# Altium schematic sheet Плата печатная.SchDoc
size 420 x 297 mm; Децимальный номер: СФ МЭИ КР ПЭ2-18 11.03.04 03; Наименование. Строка 2: плата; Наименование. Строка 1: Печатная; Разработал: Гончаренко В.Ю.; Проверил: Смолин В.А.; Утвердил: Рассказа Д,С.; Литера: У; Масштаб: 2:1; Лист. Номер: 1; Лист. Всего: 4; Организация: НИУ СФ МЭИ
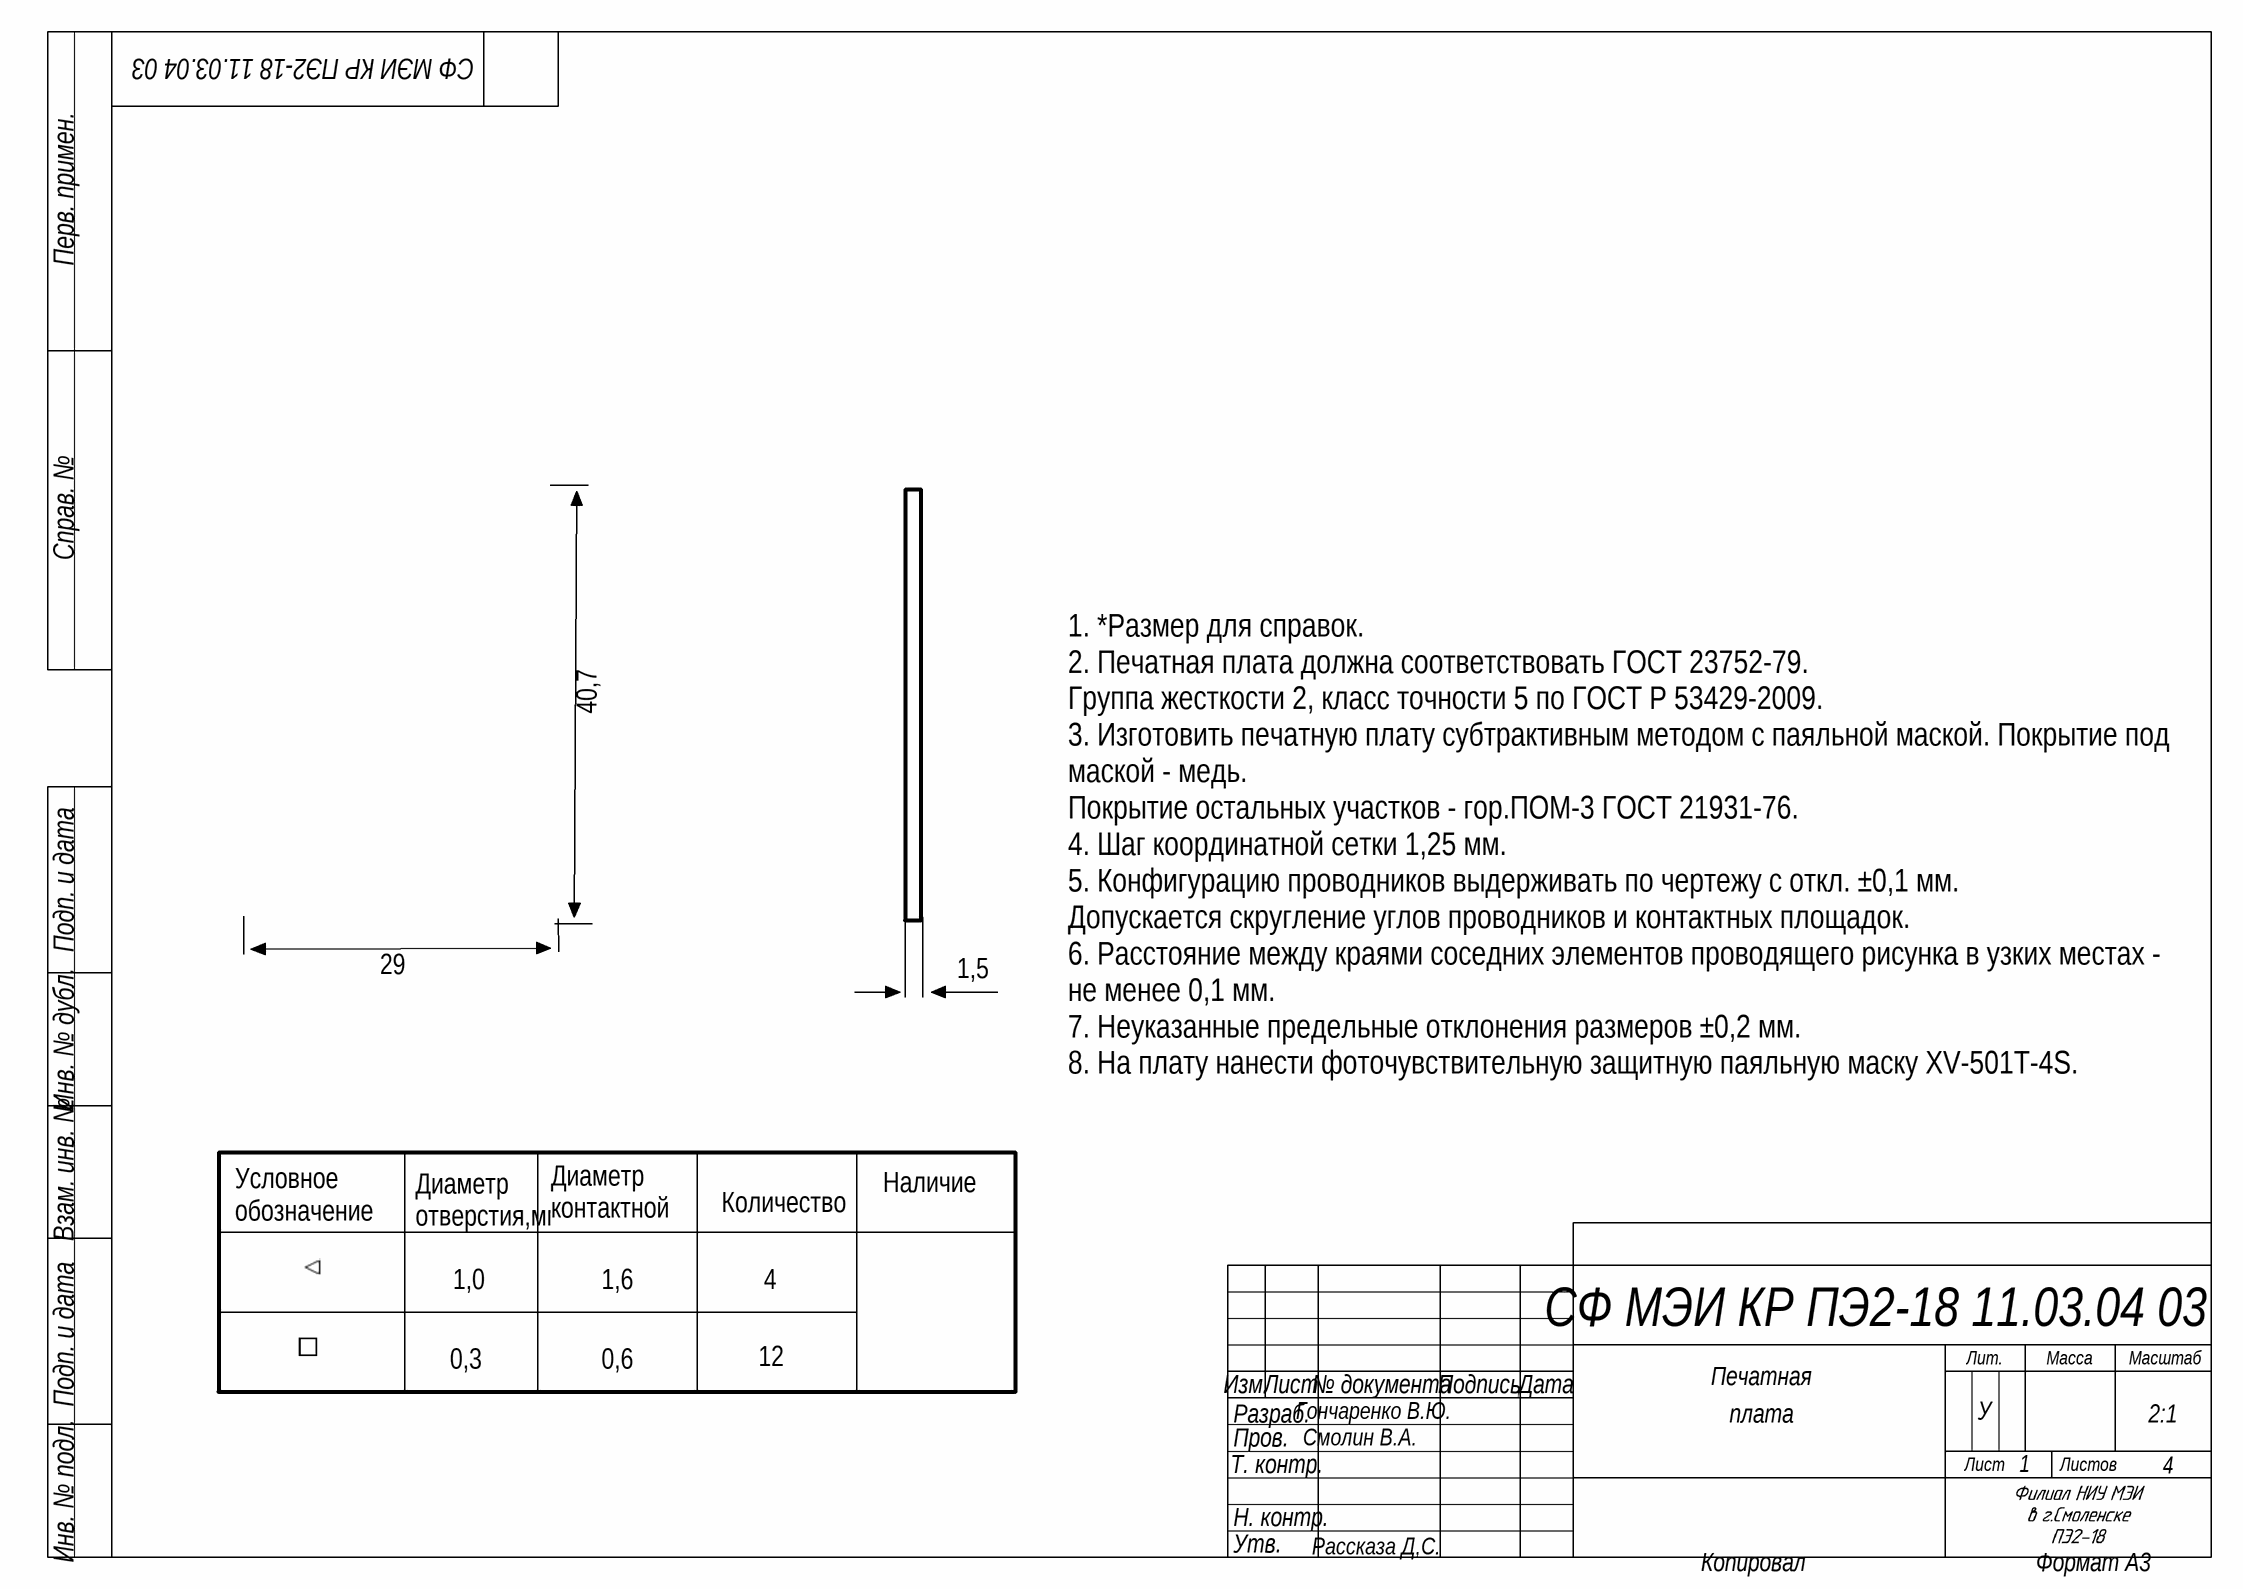
[diagram p0: Плата печатная.SchDoc]

## Notes on the sheet
- 40,7
- 29
- 1,5
- 1. *Размер для справок.
  2. Печатная плата должна соответствовать ГОСТ 23752-79.
  Группа жесткости 2, класс точности 5 по ГОСТ Р 53429-2009.
  3. Изготовить печатную плату субтрактивным методом с паяльной маской. Покрытие под маской - медь.
  Покрытие остальных участков - гор.ПОМ-3 ГОСТ 21931-76.
  4. Шаг координатной сетки 1,25 мм.
  5. Конфигурацию проводников выдерживать по чертежу с откл. ±0,1 мм.
  Допускается скругление углов проводников и контактных площадок.
  6. Расстояние между краями соседних элементов проводящего рисунка в узких местах - не менее 0,1 мм.
  7. Неуказанные предельные отклонения размеров ±0,2 мм.
  8. На плату нанести фоточувствительную защитную паяльную маску XV-501T-4S.
- Условное
  обозначение
  отверстия
- Диаметр
  отверстия,мм
- Диаметр
  контактной
  площадки,мм
- Количество
- Наличие
  металлизации
- 1,0
- 1,6
- 4
- Есть
- 0,3
- 0,6
- 12
- Перв. примен.
- Справ. №
- Подп. и дата
- Инв. № дубл.
- Взам. инв. №
- Разраб.
- Изм.
- Лист
- № документа
- Подпись
- Дата
- Лит.
- Масса
- Масштаб
- Т. контр.
- Пров.
- Листов
- Инв. № подл.
- Н. контр.
- Утв.
- Копировал
- Формат A3